# Altium schematic sheet eco_Main_v1.0.SchDoc
size A3
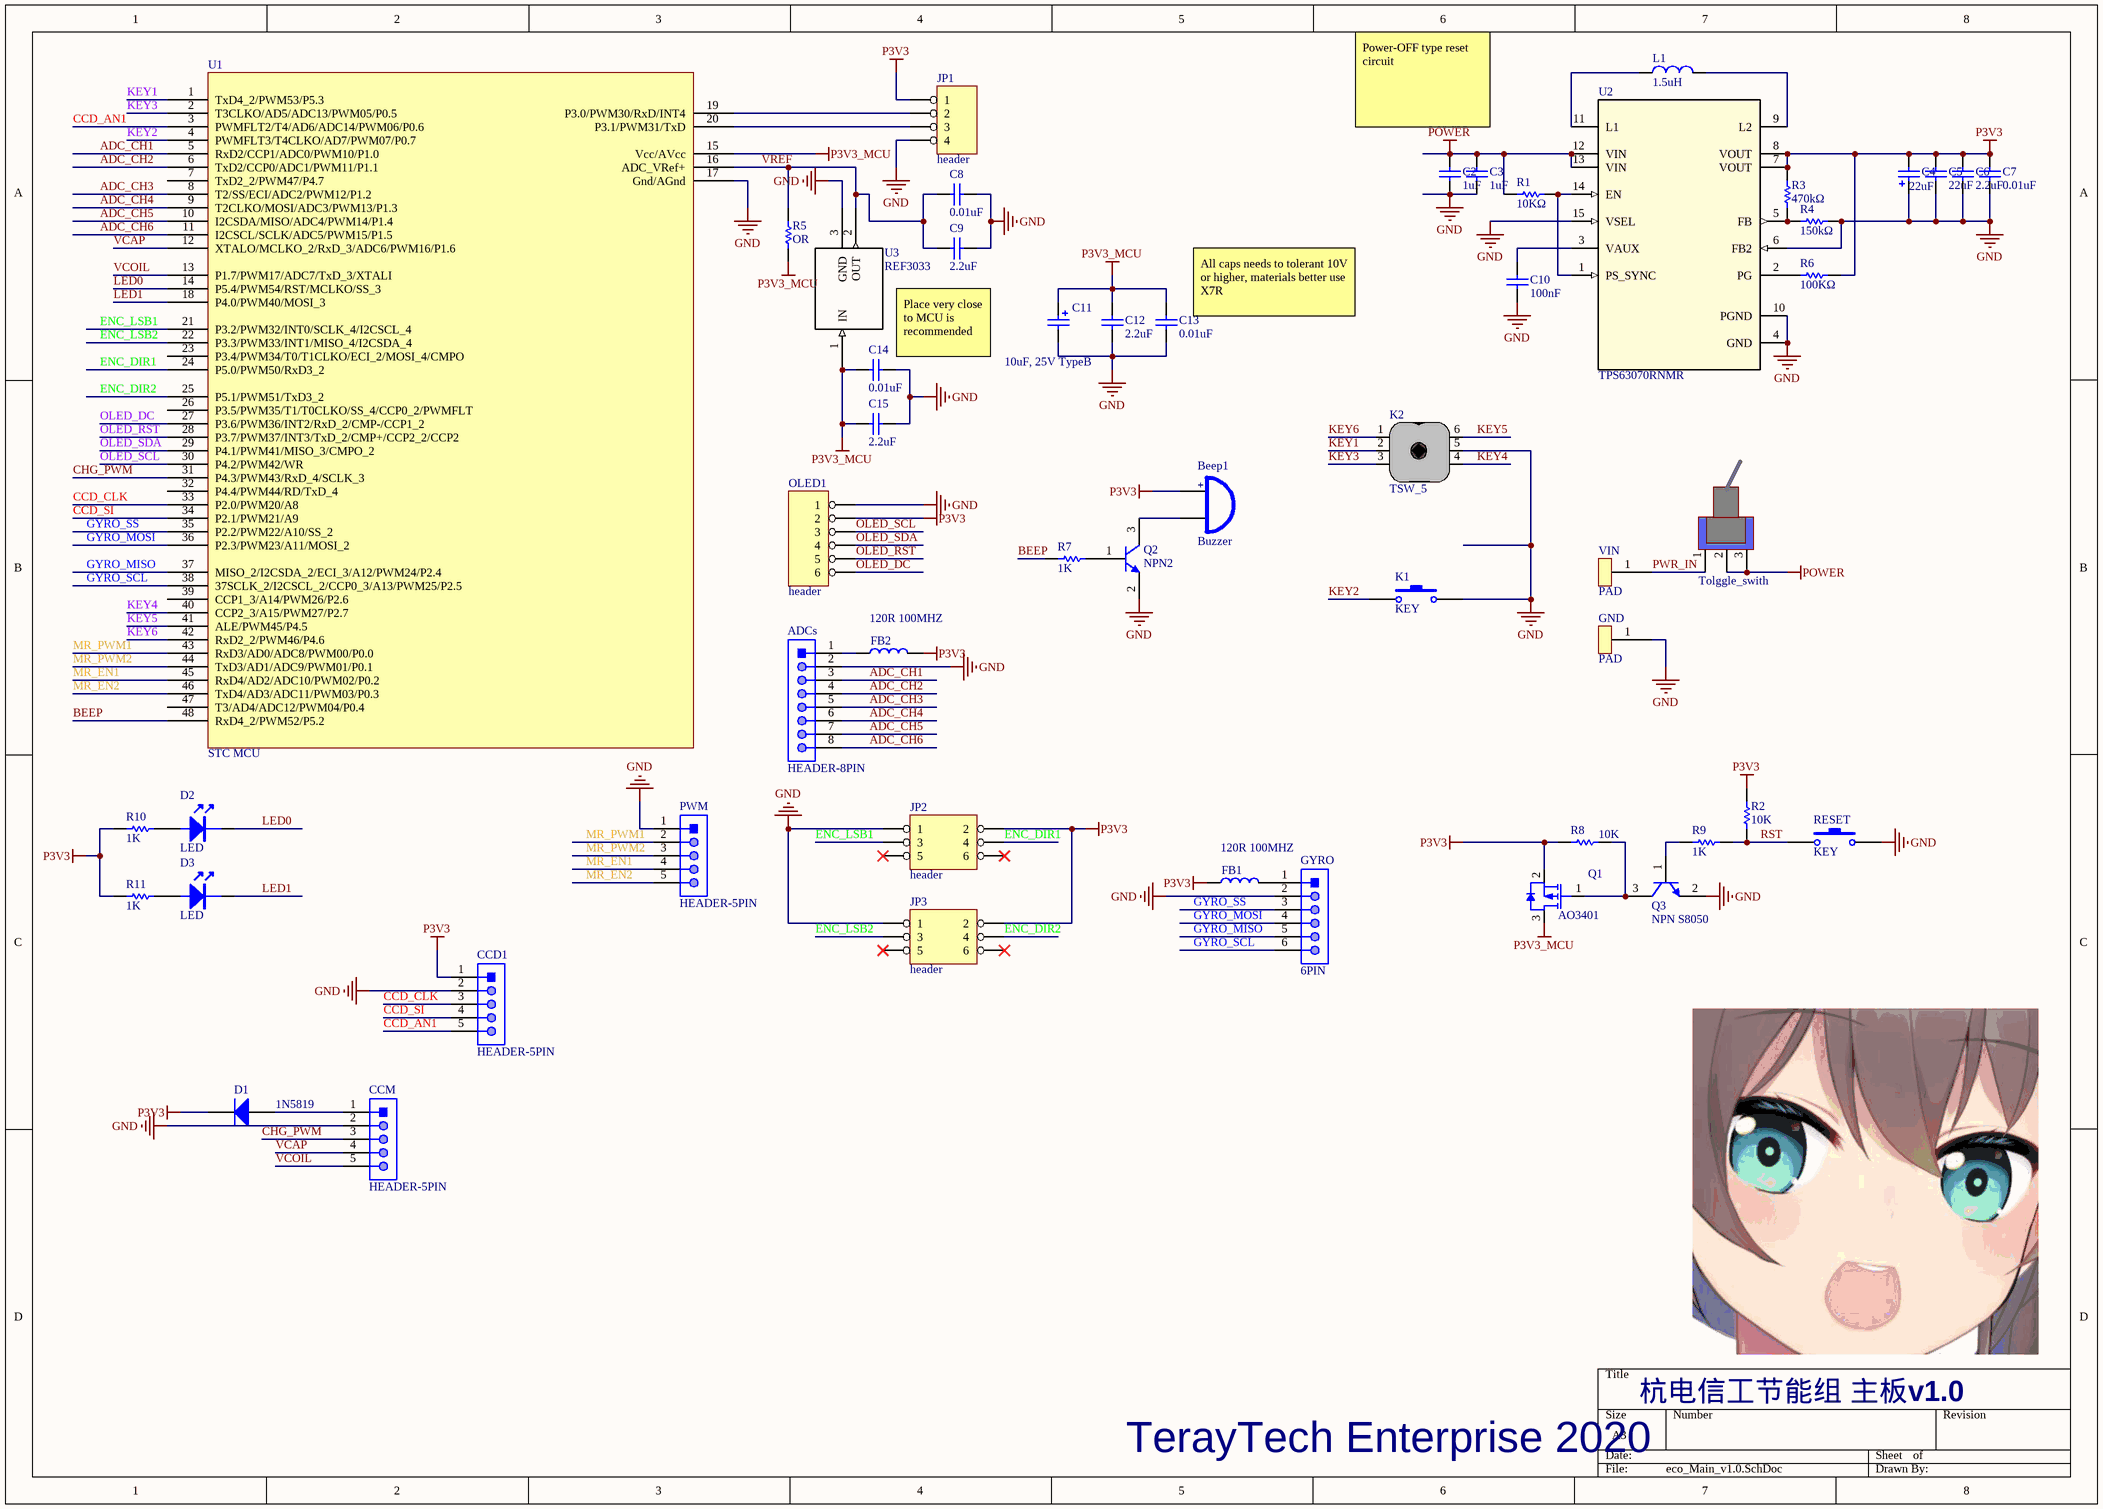
[diagram p0: eco_Main_v1.0.SchDoc]

## Parts
ADCs  HEADER-8PIN  [HEADER_8P_1.25_RT]
Beep1  Buzzer  [BUZZER_9.6*9.6*5mm]
C2  1uF  [C1206]
C3  1uF  [0603_C]
C4  22uF  [CAPC3528B]
C5  22uF  [C1206]
C6  2.2uF  [0603_C]
C7  0.01uF  [0603_C]
C8  0.01uF  [0603_C]
C9  2.2uF  [0603_C]
C10  100nF  [0603_C]
C11  10uF, 25V TypeB  [CAPC3528B]
C12  2.2uF  [0603_C]
C13  0.01uF  [0603_C]
C14  0.01uF  [0603_C]
C15  2.2uF  [0603_C]
CCD1  HEADER-5PIN  [HEADER_5P_1.25_up]
CCM  HEADER-5PIN  [HEADER_5P_1.25_RT]
D1  1N5819  [SOD123]
D2  LED  [0603_LED]
D3  LED  [0603_LED]
Energy1  Tolggle_swith  [TOGGLE SWICH STAND]
FB1  120R 100MHZ  [FB0603]
FB2  120R 100MHZ  [FB0603]
GND  PAD  [PAD]
GYRO  6PIN  [MX 1.25-WS-6P]
JP1  header  [header4]
JP2  header  [header2X3]
JP3  header  [header2X3]
K1  KEY  [贴片复位开关]
K2  TSW_5  [TSW-10]
L1  1.5uH  [L 5x5]
OLED1  header  [0.96寸OLED模块]
PWM  HEADER-5PIN  [HEADER_5P_1.25_RT]
Q1  AO3401  [SOT-23-3]
Q2  NPN2  [SOT-23-3]
Q3  NPN S8050  [SOT-23-3]
R1  10KΩ  [0603_R]
R2  10K  [0603_R]
R3  470kΩ  [0603_R]
R4  150kΩ  [0603_R]
R5  OR  [0603_R]
R6  100KΩ  [0603_R]
R7  1K  [0603_R]
R8  10K  [0603_R]
R9  1K  [0603_R]
R10  1K  [0603_R]
R11  1K  [0603_R]
RESET  KEY  [KEY_2]
U1  STC MCU  [LQFP48]
U2  TPS63070RNMR  [RNM0015A]
U3  REF3033  [DBZ3]
VIN  PAD  [PAD]

## Nets
GND: ADCs.2 C2.1 C3.1 C4.1 C5.1 C6.1 C7.1 C8.2 C9.2 C10.1 C11.2 C12.1 C13.1 C14.2 C15.2 CCD1.2 CCM.2 GND.1 GYRO.2 JP1.4 JP2.1 JP3.1 K1.2 K2.5 OLED1.1 PWM.1 Q2.2(E) Q3.2(E) R4.1 RESET.2 U1.17(Gnd/AGnd) U2.4(GND) U2.6(FB2) U2.10(PGND) U2.15(VSEL) U3.3(GND)
P3V3: Beep1.1(A) C4.2 C5.2 C6.2 C7.2 CCD1.1 D1.2(K) FB1.1 FB2.2 JP1.1 JP2.2 JP3.2 OLED1.2 Q1.2(S) R2.1 R3.2 R6.1 R8.2 R10.1 R11.1 U2.7(VOUT) U2.8(VOUT)
P3V3_MCU: C11.1 C12.2 C13.2 C14.1 C15.1 Q1.3(D) R5.2 U1.15(Vcc/AVcc) U3.1(IN)
POWER: C2.2 C3.2 Energy1.2 Energy1.3 R1.2 U2.12(VIN) U2.13(VIN)
ADC_CH1: ADCs.3 U1.5(RxD2/CCP1/ADC0/PWM10/P1.0)
ADC_CH2: ADCs.4 U1.6(TxD2/CCP0/ADC1/PWM11/P1.1)
ADC_CH3: ADCs.5 U1.8(T2/SS/ECI/ADC2/PWM12/P1.2)
ADC_CH4: ADCs.6 U1.9(T2CLKO/MOSI/ADC3/PWM13/P1.3)
ADC_CH5: ADCs.7 U1.10(I2CSDA/MISO/ADC4/PWM14/P1.4)
ADC_CH6: ADCs.8 U1.11(I2CSCL/SCLK/ADC5/PWM15/P1.5)
BEEP: R7.1 U1.48(RxD4_2/PWM52/P5.2)
CCD_AN1: CCD1.5 U1.3(PWMFLT2/T4/AD6/ADC14/PWM06/P0.6)
CCD_CLK: CCD1.3 U1.33(P2.0/PWM20/A8)
CCD_SI: CCD1.4 U1.34(P2.1/PWM21/A9)
CHG_PWM: CCM.3 U1.31(P4.3/PWM43/RxD_4/SCLK_3)
ENC_DIR1: JP2.4 U1.24(P5.0/PWM50/RxD3_2)
ENC_DIR2: JP3.4 U1.25(P5.1/PWM51/TxD3_2)
ENC_LSB1: JP2.3 U1.21(P3.2/PWM32/INT0/SCLK_4/I2CSCL_4)
ENC_LSB2: JP3.3 U1.22(P3.3/PWM33/INT1/MISO_4/I2CSDA_4)
GYRO_MISO: GYRO.5 U1.37(MISO_2/I2CSDA_2/ECI_3/A12/PWM24/P2.4)
GYRO_MOSI: GYRO.4 U1.36(P2.3/PWM23/A11/MOSI_2)
GYRO_SCL: GYRO.6 U1.38(37SCLK_2/I2CSCL_2/CCP0_3/A13/PWM25/P2.5)
GYRO_SS: GYRO.3 U1.35(P2.2/PWM22/A10/SS_2)
KEY1: K2.2 U1.1(TxD4_2/PWM53/P5.3)
KEY2: K1.1 U1.4(PWMFLT3/T4CLKO/AD7/PWM07/P0.7)
KEY3: K2.3 U1.2(T3CLKO/AD5/ADC13/PWM05/P0.5)
KEY4: K2.4 U1.40(CCP2_3/A15/PWM27/P2.7)
KEY5: K2.6 U1.41(ALE/PWM45/P4.5)
KEY6: K2.1 U1.42(RxD2_2/PWM46/P4.6)
LED0: D2.2(K) U1.14(P5.4/PWM54/RST/MCLKO/SS_3)
LED1: D3.2(K) U1.18(P4.0/PWM40/MOSI_3)
MR_EN1: PWM.4 U1.45(RxD4/AD2/ADC10/PWM02/P0.2)
MR_EN2: PWM.5 U1.46(TxD4/AD3/ADC11/PWM03/P0.3)
MR_PWM1: PWM.2 U1.43(RxD3/AD0/ADC8/PWM00/P0.0)
MR_PWM2: PWM.3 U1.44(TxD3/AD1/ADC9/PWM01/P0.1)
OLED_DC: OLED1.6 U1.27(P3.6/PWM36/INT2/RxD_2/CMP-/CCP1_2)
OLED_RST: OLED1.5 U1.28(P3.7/PWM37/INT3/TxD_2/CMP+/CCP2_2/CCP2)
OLED_SCL: OLED1.3 U1.30(P4.2/PWM42/WR)
OLED_SDA: OLED1.4 U1.29(P4.1/PWM41/MISO_3/CMPO_2)
PWR_IN: Energy1.1 VIN.1
RST: R2.2 R9.2 RESET.1
VCAP: CCM.4 U1.12(XTALO/MCLKO_2/RxD_3/ADC6/PWM16/P1.6)
VCOIL: CCM.5 U1.13(P1.7/PWM17/ADC7/TxD_3/XTALI)
VREF: C8.1 C9.1 R5.1 U1.16(ADC_VRef+) U3.2(OUT)
NetADCs_1: ADCs.1 FB2.1
NetBeep1_2: Beep1.2(B) Q2.3(C)
NetC10_2: C10.2 U2.3(VAUX)
NetCCM_1: CCM.1 D1.1(A)
NetD2_1: D2.1(A) R10.2
NetD3_1: D3.1(A) R11.2
NetFB1_2: FB1.2 GYRO.1
NetJP1_2: JP1.2 U1.19(P3.0/PWM30/RxD/INT4)
NetJP1_3: JP1.3 U1.20(P3.1/PWM31/TxD)
NetL1_1: L1.1 U2.11(L1)
NetL1_2: L1.2 U2.9(L2)
NetQ1_1: Q1.1(G) Q3.3(C) R8.1
NetQ2_1: Q2.1(B) R7.2
NetQ3_1: Q3.1(B) R9.1
NetR1_1: R1.1 U2.1(PS_SYNC) U2.14(EN)
NetR3_1: R3.1 R4.2 U2.5(FB)
NetR6_2: R6.2 U2.2(PG)

Not connected (* = marked no-connect by the designer): JP2 5* 6*; JP3 5* 6*; U1 7(TxD2_2/PWM47/P4.7) 23(P3.4/PWM34/T0/T1CLKO/ECI_2/MOSI_4/CMPO) 26(P3.5/PWM35/T1/T0CLKO/SS_4/CCP0_2/PWMFLT) 32(P4.4/PWM44/RD/TxD_4) 39(CCP1_3/A14/PWM26/P2.6) 47(T3/AD4/ADC12/PWM04/P0.4)

## Notes on the sheet
- Power-OFF type reset circuit
- (near C13) All caps needs to tolerant 10V or higher, materials better use X7R
- (near C14) Place very close to MCU is recommended
- TerayTech Enterprise 2020
- 杭电信工节能组 主板v1.0
- (in symbol Buzzer) +

## Library data of the parts
C2 C3 C5-C10 C12-C15 = CAP: Capacitor; Value: 104; Published: 8-Jun-2000; LatestRevisionDate: 17-Jul-2002; LatestRevisionNote: Re-released for DXP Platform.; PackageReference: RAD-0.3; Publisher: Altium Limited
C4 C11 = CAP_tan: Capacitor; Value: 104; Published: 8-Jun-2000; LatestRevisionDate: 17-Jul-2002; LatestRevisionNote: Re-released for DXP Platform.; PackageReference: RAD-0.3; Publisher: Altium Limited
D1 = 1N5819: 40V 1A PEAK 25a
D2 D3 = LED: LED 发光二极管
FB1 FB2 = FB: 120OHM@100MHZ 2A 25% 0603
GYRO = HEADER-6PIN
JP1 = HEADER 4
JP2 JP3 = HEADER 3X2
K1 RESET = KEY_2: Switch; Published: 24-Mar-1999; LatestRevisionDate: 17-Jul-2002; LatestRevisionNote: Re-released for DXP Platform.; PackageReference: SPST-2; Publisher: Altium Limited
K2 = TSW_5: 方向开关
L1 = Inductor
OLED1 = HEADER 6
Q1 = p-MOSEFT_SMALL
Q2 Q3 = NPN2: 贴片
R1-R6 R8 = RES0: Resistor; Value: 1K; Published: 8-Jun-2000; Revision: July-2002: Re-released for DXP Platform.; Publisher: Altium Limited
R7 = RES: Resistor; Published: 8-Jun-2000; Revision: July-2002: Re-released for DXP Platform.; Publisher: Altium Limited; Value: 1K
R9-R11 = RES0: Resistor; Published: 8-Jun-2000; Revision: July-2002: Re-released for DXP Platform.; Publisher: Altium Limited; Value: 1K
U1 = STC8G2K64S4
U2 = TPS63070RNMR: Imported; Manufacturer: Texas Instruments; PartNumber: TPS63070RNMR; RefDes: RefDes; Type: TYPE; Value: Value
U3 = REF3033_DBZ_3: Imported; Manufacturer: Texas Instruments; INDUSTRY_STD_PKG_TYPE: SOT-23; FAMILY_NAME: SERIES VOLTAGE REFERENCE; PIN_COUNT: 3; PACKAGE_DESIGNATOR: DBZ; Datasheet URL: http://www.ti.com/lit/gpn/REF3033; GENERIC_PART_NUMBER: REF3033; Vendor: Texas Instruments; Manufacturer_Part_Number: ref3033_dbz_3; RefDes: RefDes; Type: DEV; Value: Value